# EasyEDA Pro project IMS_Baseboard.eprj

# Schematic Schematic1
Board Name: Board1; Create Date: 2025-12-21; Page Name: P1; Project Name: IMS_Baseboard; Schematic Name: Schematic1; Update Date: 2025-12-21; Company: 嘉立创EDA; Page Size: A4; Version: V1.0
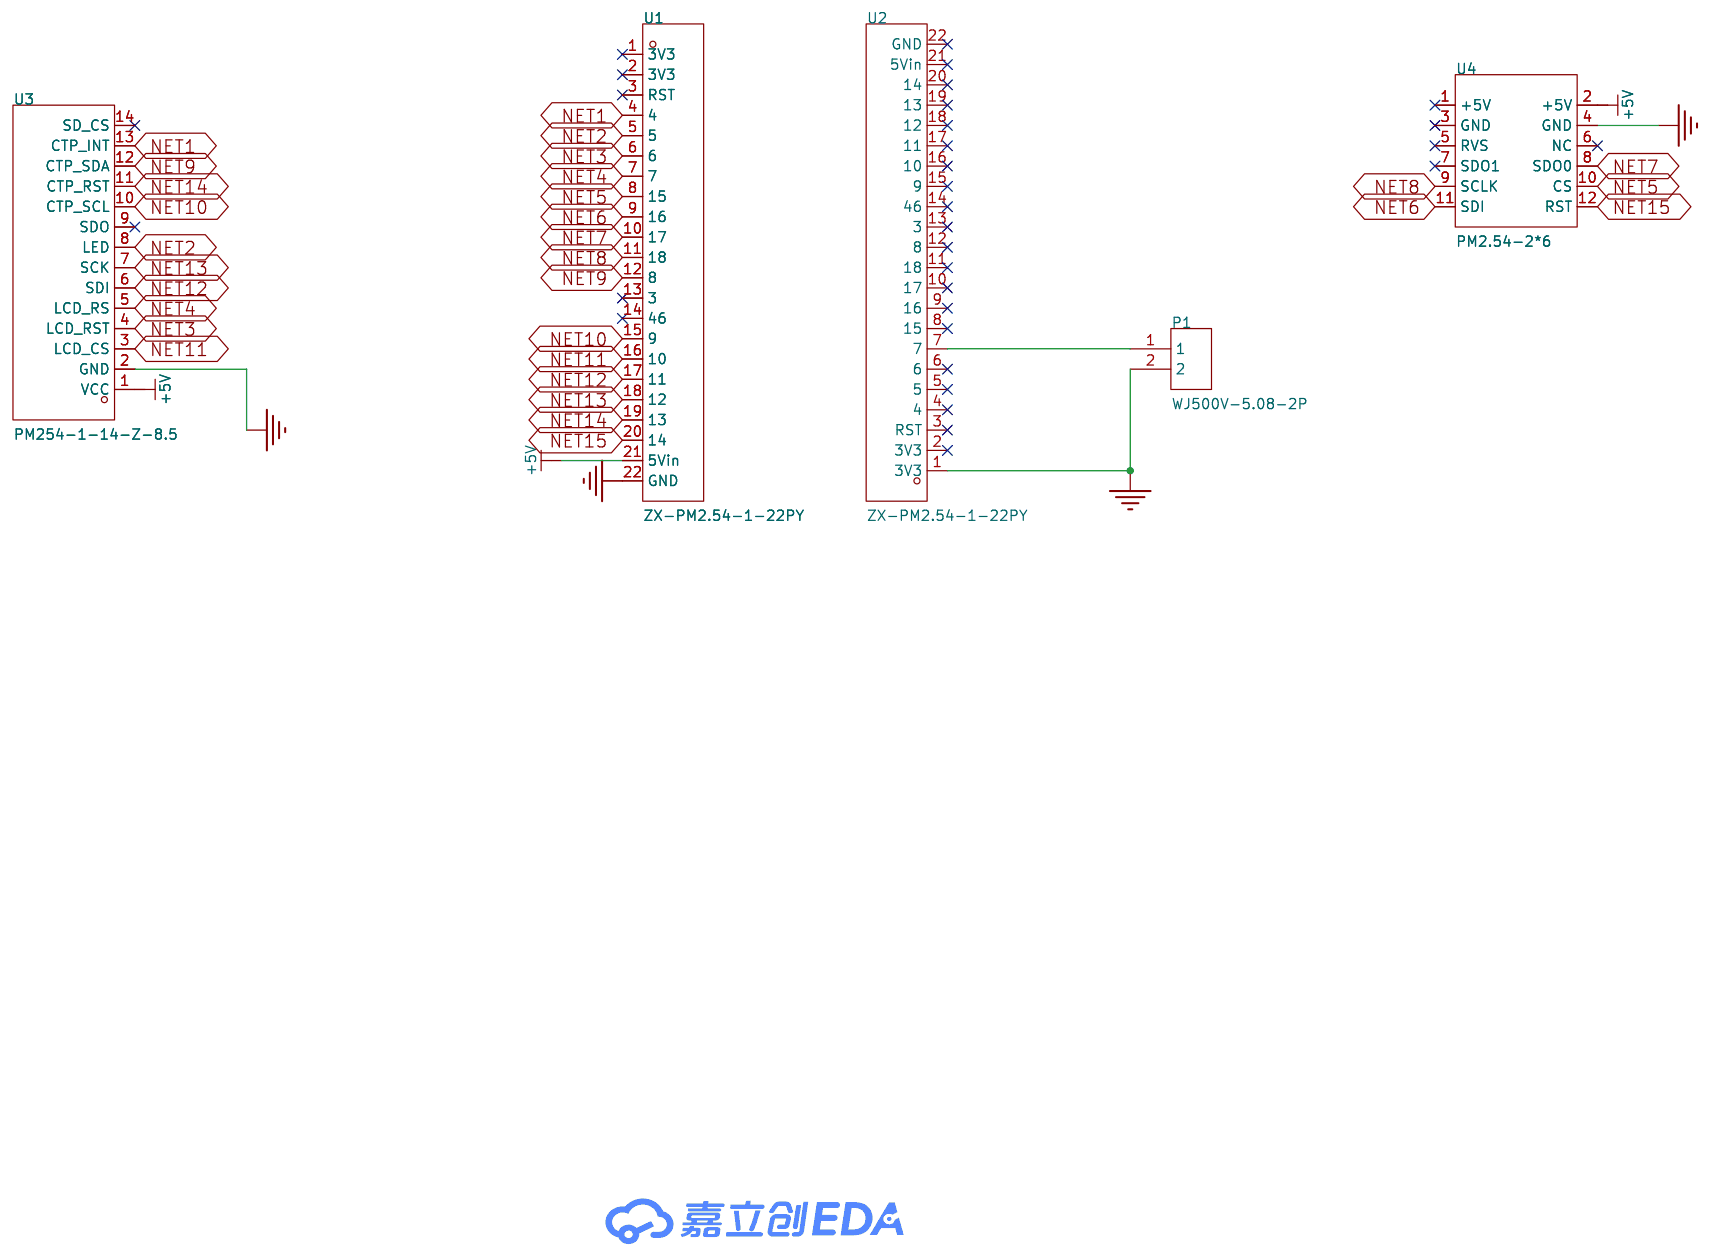
[diagram p0: schematic sheet]

## Parts
P1  WJ500V-5.08-2P  [CONN-TH_2P-P5.00_WJ500V-5.08-2P]
U1  ZX-PM2.54-1-22PY  [HDR-TH_22P-P2.54-V-F]
U2  ZX-PM2.54-1-22PY  [HDR-TH_22P-P2.54-V-F]
U3  PM254-1-14-Z-8.5  [HDR-TH_14P-P2.54-V-F-1]
U4  PM2.54-2*6  [HDR-TH_12P-P2.54-V-F-R2-C6-S2.54]

## Library data of the parts
P1 = WJ500V-5.08-2P: LCSC Part Name: 1x2P 5.08mm 直插 排数:1 每排P数:2; Supplier Part: C8465; Manufacturer: KANGNEX(康奈克斯电气); Supplier Footprint: 插件,P=5.08mm; JLCPCB Part Class: 扩展库; Datasheet: https://atta.szlcsc.com/upload/public/pdf/source/20191225/C8465_02D34CE5B5B4A53DF5891601D97FA9F4.pdf; Supplier: LCSC; Structure: 1x2P; Pitch: 5.08mm; Color: 绿色; Mounting Style: 直插; Current Rating (Max): 18A; Voltage Rating (Max): 250V; Number of Pins: 2P; Number of Rows: 1; Wire Gauge - AWG: 14~30; Wire Gauge - mm2: 2.5; Number of PINs Per Row: 2; Operating Temperature Range: -40℃~+105℃; Screw Specification: M2.5
U1 = ZX-PM2.54-1-22PY: 插孔结构:1x22P;间距:2.54mm;行距:-;圆孔/方孔:方孔;安装方式:直插;排数:单排;总孔位数:22P;额定电流:3A;额定电压:-;插孔方向:顶部;塑高:8.5mm;触头材质:黄铜;触头镀层:金;工作温度:-40℃~+105℃;; LCSC Part Name: 1x22P 间距:2.54mm 直插; Supplier Part: C7499337; Manufacturer: Megastar(兆星); Supplier Footprint: 插件,P=2.54mm; JLCPCB Part Class: 扩展库; Datasheet: https://item.szlcsc.com/datasheet/ZX-PM2.54-1-22PY/8573998.html; Supplier: LCSC; Holes Structure: 1x22P; Pitch: 2.54mm; Circular Hole / Square Hole: 方孔; Mounting Type: 直插; Number of Rows: 单排; Number of Positions: 22P; Current Rating: 3A; Holes Direction: 顶部; Insulation Height: 8.5mm; Contact Material: 黄铜; Contact Plating: 金; Operating Temperature: -40℃~+105℃; PIN Length: 3.2mm
U2 = ZX-PM2.54-1-22PY: LCSC Part Name: 1x22P 间距:2.54mm 直插; Supplier Part: C7499337; Manufacturer: Megastar(兆星); Supplier Footprint: 插件,P=2.54mm; Datasheet: https://item.szlcsc.com/datasheet/ZX-PM2.54-1-22PY/8573998.html; Supplier: LCSC; Holes Structure: 1x22P; Pitch: 2.54mm; Circular Hole / Square Hole: 方孔; Mounting Type: 直插; Number of Rows: 单排; Number of Positions: 22P; Current Rating: 3A; Holes Direction: 顶部; Insulation Height: 8.5mm; Contact Material: 黄铜; Contact Plating: 金; Operating Temperature: -40℃~+105℃; PIN Length: 3.2mm
U3 = PM254-1-14-Z-8.5-gai: LCSC Part Name: 1x14P 间距:2.54mm 直插; Supplier Part: C2897377; Manufacturer: HCTL(华灿天禄); Supplier Footprint: 插件,P=2.54mm; Datasheet: https://item.szlcsc.com/datasheet/PM254-1-14-Z-8.5/3142382.html; Supplier: LCSC; Holes Structure: 1x14P; Pitch: 2.54mm; Circular Hole / Square Hole: 方孔; Mounting Type: 直插; Number of Rows: 单排; Number of Positions: 14P; Current Rating: 3A; Holes Direction: 顶部; Insulation Height: 8.5mm; Contact Material: 铜合金; Operating Temperature: -40℃~+105℃
U4 = PM2.54-2*6-gai: LCSC Part Name: 2x6P 间距:2.54mm 直插; Supplier Part: C5307342; Manufacturer: ZHOURI(洲日); Supplier Footprint: 插件,P=2.54mm; Datasheet: https://item.szlcsc.com/datasheet/PM2.54-2*6/6060116.html; Supplier: LCSC; Holes Structure: 2x6P; Pitch: 2.54mm; Circular Hole / Square Hole: 方孔; Mounting Type: 直插; Number of Rows: 双排; Number of Positions: 12P; Current Rating: 2.5A; Holes Direction: 顶部; Insulation Height: 8.5mm; Contact Material: 黄铜; Operating Temperature: -40℃~+105℃; PIN Length: 3.2mm

## Nets
+5V: U1.21(5Vin) U3.1(VCC) U4.2(+5V)
GND: U1.22(GND) U3.2(GND)
GND1: P1.2 U2.1(GND) U4.4(GND)
NET1: U1.4 U3.13(CTP_INT)
NET2: U1.5 U3.8(LED)
NET3: U1.6 U3.4(LCD_RST)
NET4: U1.7 U3.5(LCD_RS)
NET5: U1.8(15) U4.10(CS)
NET6: U1.9(16) U4.11(SDI)
NET7: U1.10(17) U4.8(SDO0)
NET8: U1.11(18) U4.9(SCLK)
NET9: U1.12(8) U3.12(CTP_SDA)
NET10: U1.15(9) U3.10(CTP_SCL)
NET11: U1.16(10) U3.3(LCD_CS)
NET12: U1.17(11) U3.6(SDI)
NET13: U1.18(12) U3.7(SCK)
NET14: U1.19(13) U3.11(CTP_RST)
NET15: U1.20(14) U4.12(RST)
$1N4400: P1.1 U2.7(48)

Not connected (* = marked no-connect by the designer): U1 1(3V3)* 2(3V3)* 3(RST)* 13(3)* 14(46)*; U2 2(GND)* 3(19)* 4(20)* 5(21)* 6(47)* 8(45)* 9(0)* 10(35)* 11(36)* 12(37)* 13(38)* 14(39)* 15(40)* 16(41)* 17(42)* 18(2)* 19(1)* 20(RX)* 21(TX)* 22(GND)*; U3 9(SDO)* 14(SD_CS)*; U4 1(+5V)* 3(GND)* 5(RVS)* 6(NC)* 7(SDO1)*

# Board v1.0
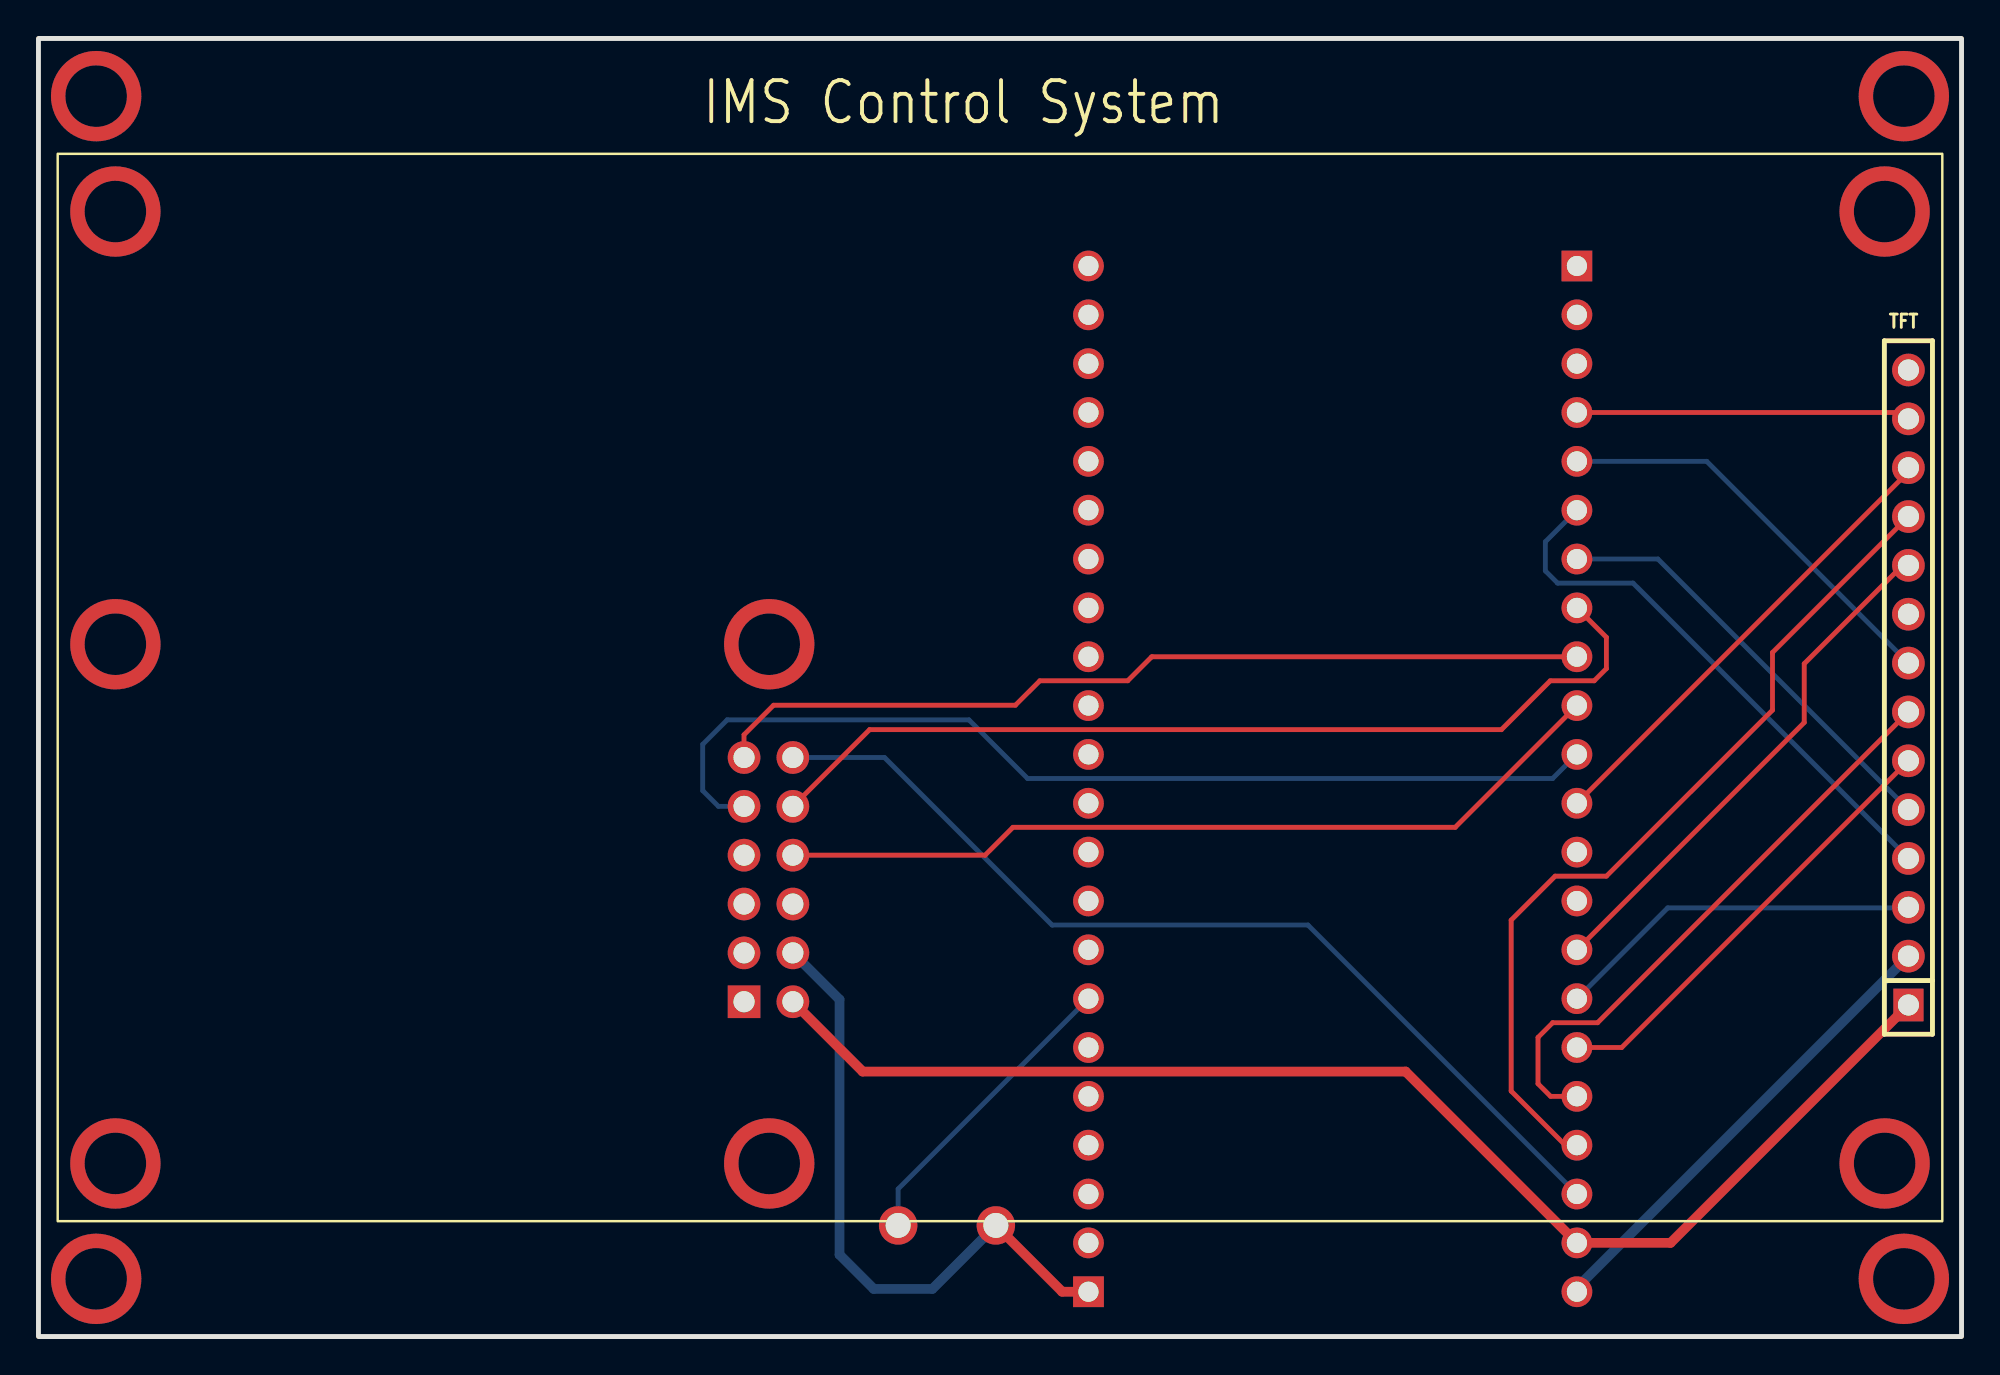
[diagram p1: board, top side]
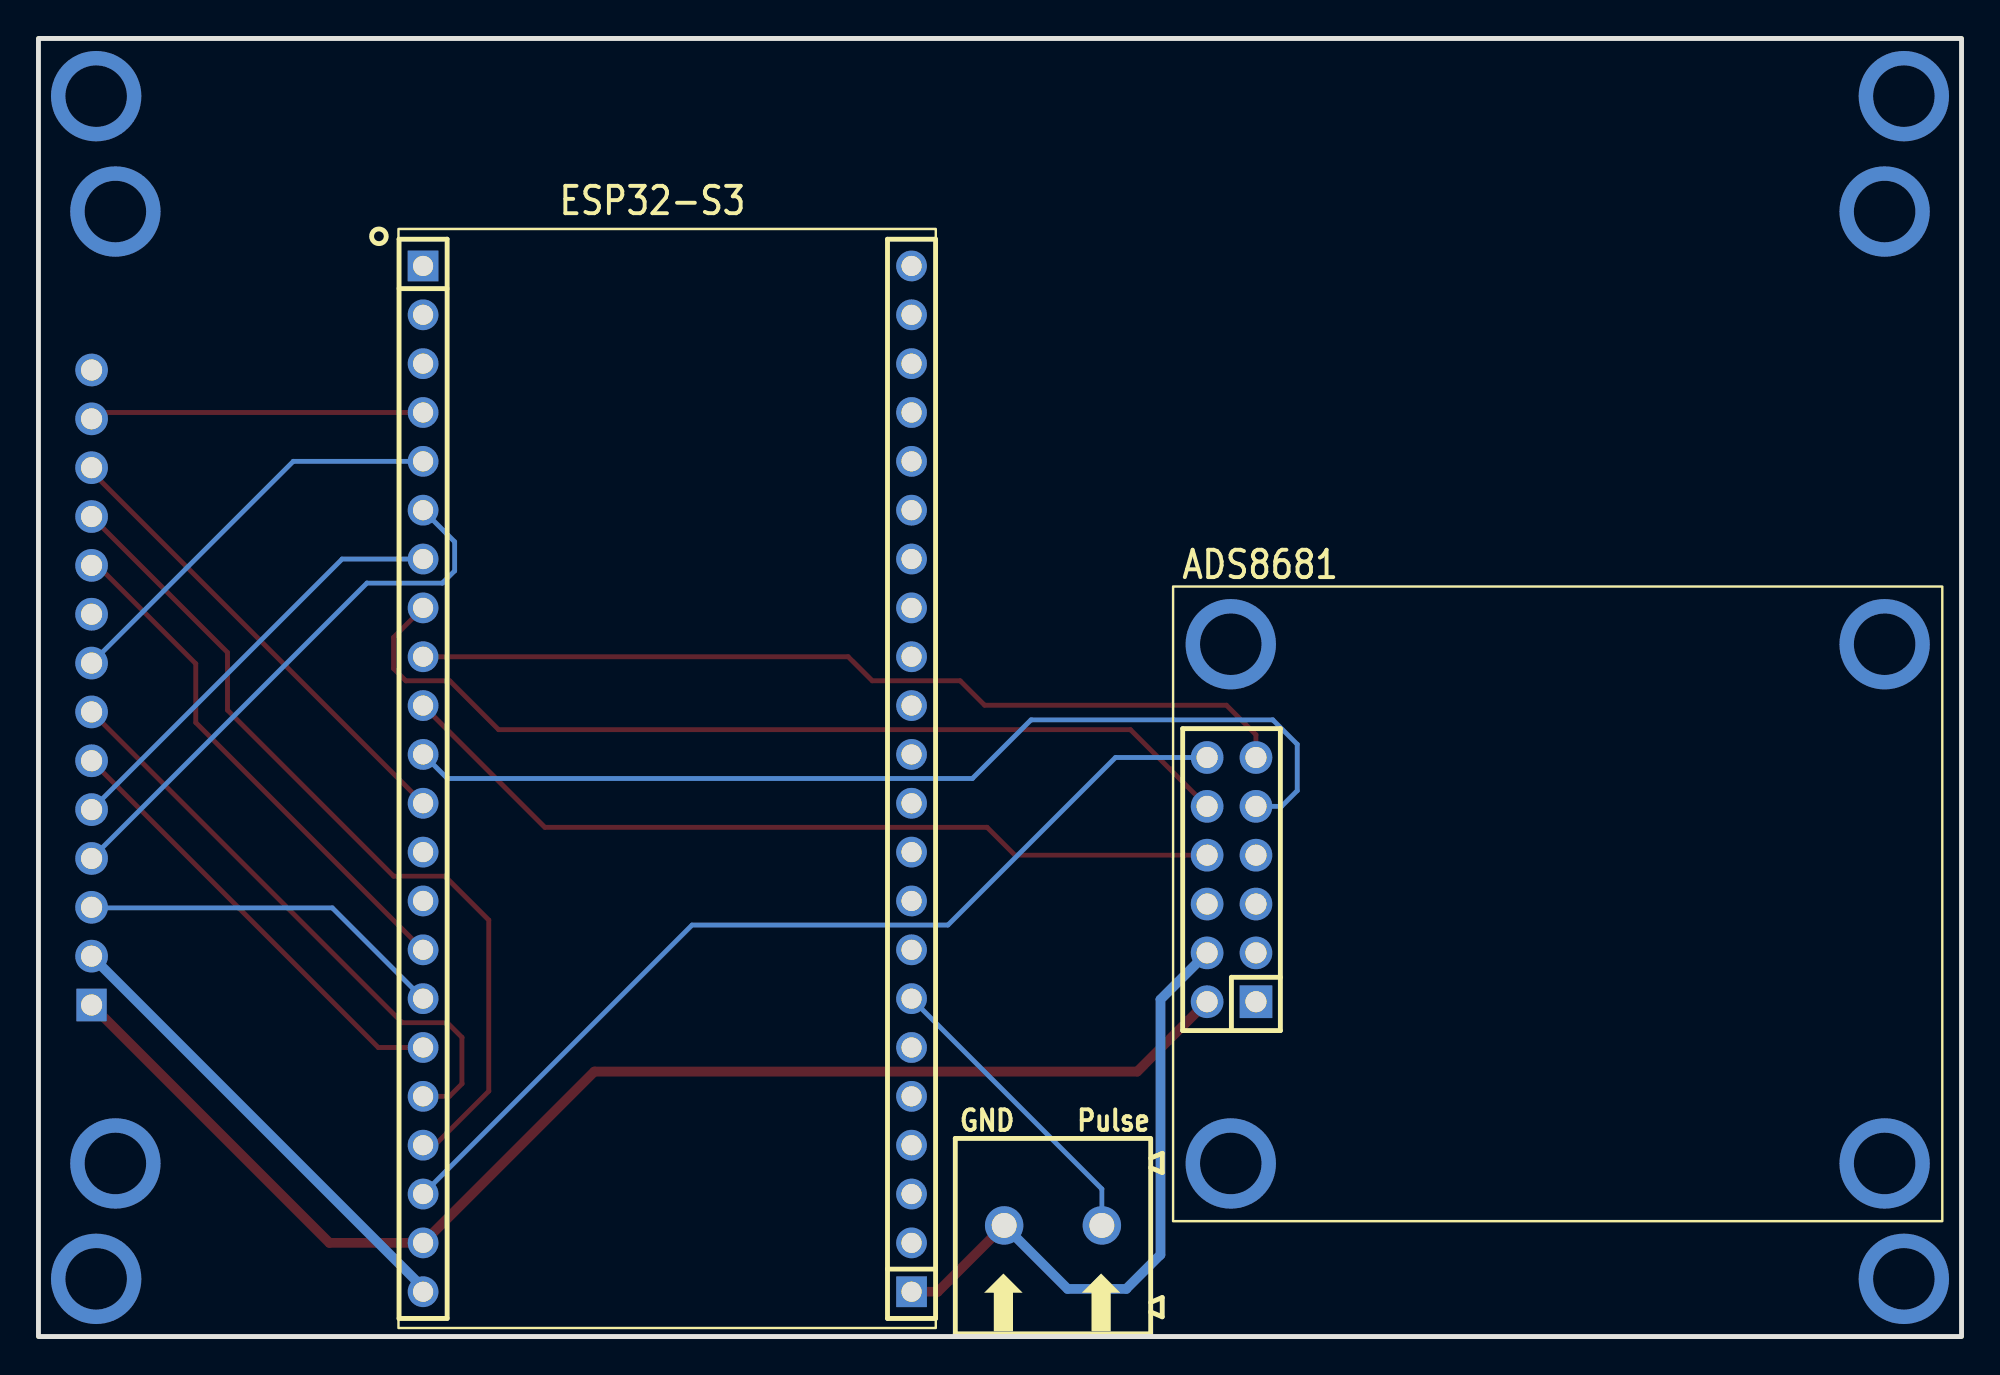
[diagram p2: board, bottom side, seen from below]

Outline 100 x 67.5 mm; copper layers: Top Layer, Bottom Layer. Coordinates in mm from the lower left corner of the outline.
Outline path: rectangle 0,67.5 100,0
Stack: Top Layer 0.035mm / Dielectric1 1.51mm FR4 er 4.5 / Bottom Layer 0.035mm

## Design rules (mm)
template: JLCPCB Capability(Two Layers Board)
spacing copperThickness1oz (default): track to track 0.102, other pairs 0.152 to 0.3
spacing copperThickness2oz: track to track 0.203, other pairs 0.152 to 0.3
track width copperThickness1oz (default): min 0.127, default 0.254, max 2.54
track width copperThickness2oz: min 0.203, default 0.254, max 2.54
differential pair differentialPair (default): width min 0.127, default 0.254, max 2.54; gap min 0.152, default 0.152
via viaSize (default): diameter min 0.5, default 0.61, max 10; hole min 0.3, default 0.305, max 6.3

## Placement (name value [footprint] x y rotation side)
P1  WJ500V-5.08-2P  [CONN-TH_2P-P5.00_WJ500V-5.08-2P]  47.24 5.78 0 bottom
TFT  PM254-1-14-Z-8.5  [HDR-TH_14P-P2.54-V-F-1]  97.24 33.75 90 top
U1  ZX-PM2.54-1-22PY  [HDR-TH_22P-P2.54-V-F]  80 29 270 bottom
U2  ZX-PM2.54-1-22PY  [HDR-TH_22P-P2.54-V-F]  54.6 29 90 bottom
U4  PM2.54-2*6  [HDR-TH_12P-P2.54-V-F-R2-C6-S2.54]  37.96 23.76 90 bottom

## Footprints (pads in the part's own frame, mm; a bottom-side part is the same pattern mirrored in y, then rotated)
CONN-TH_2P-P5.00_WJ500V-5.08-2P
  round 2 hole 1.3: 1(-2.54,0) 2(2.54,0)
HDR-TH_12P-P2.54-V-F-R2-C6-S2.54
  rect 1.7x1.7 hole 1.1: 1(-6.35,-1.27)
  round 1.7 hole 1.1: 2(-6.35,1.27) 3(-3.81,-1.27) 4(-3.81,1.27) 5(-1.27,-1.27) 6(-1.27,1.27) 7(1.27,-1.27) 8(1.27,1.27) 9(3.81,-1.27) 10(3.81,1.27) 11(6.35,-1.27) 12(6.35,1.27)
HDR-TH_14P-P2.54-V-F-1
  rect 1.7x1.575 hole 1.1: 1(-16.51,0)
  round 1.7 hole 1.1: 2(-13.97,0) 3(-11.43,0) 4(-8.89,0) 5(-6.35,0) 6(-3.81,0) 7(-1.27,0) 8(1.27,0) 9(3.81,0) 10(6.35,0) 11(8.89,0) 12(11.43,0) 13(13.97,0) 14(16.51,0)
HDR-TH_22P-P2.54-V-F
  rect 1.6x1.6 hole 1.05: 1(-26.67,0)
  round 1.6 hole 1.05: 2(-24.13,0) 3(-21.59,0) 4(-19.05,0) 5(-16.51,0) 6(-13.97,0) 7(-11.43,0) 8(-8.89,0) 9(-6.35,0) 10(-3.81,0) 11(-1.27,0) 12(1.27,0) 13(3.81,0) 14(6.35,0) 15(8.89,0) 16(11.43,0) 17(13.97,0) 18(16.51,0) 19(19.05,0) 20(21.59,0) 21(24.13,0) 22(26.67,0)

## Nets
+5V: TFT.1 U1.21 U4.2
GND: TFT.2 U1.22
GND1: P1.2 U2.1 U4.4
NET1: TFT.13 U1.4
NET2: TFT.8 U1.5
NET3: TFT.4 U1.6
NET4: TFT.5 U1.7
NET5: U1.8 U4.10
NET6: U1.9 U4.11
NET7: U1.10 U4.8
NET8: U1.11 U4.9
NET9: TFT.12 U1.12
NET10: TFT.10 U1.15
NET11: TFT.3 U1.16
NET12: TFT.6 U1.17
NET13: TFT.7 U1.18
NET14: TFT.11 U1.19
NET15: U1.20 U4.12
$1N4400: P1.1 U2.7

Pads without a net: TFT 9 14; U1 1 2 3 13 14; U2 2 3 4 5 6 8 9 10 11 12 13 14 15 16 17 18 19 20 21 22; U4 1 3 5 6 7

## Via types
v1: diameter 4.7, hole 3.2, Top Layer to Bottom Layer, 11 vias

## Routing (per net, layer and track width the routed paths; a pad name or vN(x,y) marks a point on that pad's centre or on a via; arc(x,y) is an arc through that point)
+5V: length 68.3
  Top Layer w0.508: TFT.1 84.87,4.87 U1.21 71.09,13.78 42.86,13.78 U4.2
GND: length 24.6
  Bottom Layer w0.508: U1.22 80,2.54 TFT.2
GND1: length 33.2
  Top Layer w0.508: U2.1 53.23,2.33 P1.2
  Bottom Layer w0.508: P1.2 46.48,2.48 43.43,2.48 41.66,4.25 41.66,17.52 U4.4
(no net):
  vias: v1(3,64.5) v1(3,3) v1(4,58.5) v1(4,36) v1(4,9) v1(38,36) v1(38,9) v1(96,58.5) v1(96,9) v1(97,64.5) v1(97,3)
NET1: length 17.4
  Top Layer w0.254: U1.4 96.91,48.05 TFT.13
NET2: length 21.6
  Bottom Layer w0.254: U1.5 86.75,45.51 TFT.8
NET3: length 28.9
  Bottom Layer w0.254: U1.6 78.36,41.33 78.36,39.81 78.99,39.18 82.92,39.18 TFT.4
NET4: length 22.6
  Bottom Layer w0.254: TFT.5 84.21,40.43 U1.7
NET5: length 49.1
  Top Layer w0.254: U4.10 43.22,31.56 76.07,31.56 78.61,34.1 80.9,34.1 81.53,34.73 81.53,36.36 U1.8
NET6: length 46.2
  Top Layer w0.254: U1.9 57.89,35.35 56.64,34.1 52.07,34.1 50.8,32.83 38.23,32.83 36.69,31.29 U4.11
NET7: length 44
  Top Layer w0.254: U4.8 49.22,25.03 50.67,26.48 73.67,26.48 U1.10
NET8: length 52.7
  Bottom Layer w0.254: U1.11 79.99,30.27 78.74,29.02 51.44,29.02 48.39,32.07 35.81,32.07 34.54,30.8 34.54,28.38 35.36,27.57 U4.9
NET9: length 24.6
  Top Layer w0.254: TFT.12 97.24,44.97 U1.12
NET10: length 27.3
  Top Layer w0.254: U1.15 91.82,31.93 91.82,34.99 96.93,40.1 TFT.10
NET11: length 19.2
  Bottom Layer w0.254: TFT.3 97.21,22.29 84.72,22.29 U1.16
NET12: length 23.4
  Top Layer w0.254: TFT.6 82.33,15.03 U1.17
NET13: length 31
  Top Layer w0.254: U1.18 78.63,12.49 77.98,13.14 77.98,15.56 78.74,16.32 81.08,16.32 TFT.7
NET14: length 44.6
  Top Layer w0.254: TFT.11 90.17,35.57 90.17,32.58 81.53,23.94 78.87,23.94 76.58,21.65 76.58,12.76 79.39,9.95 U1.19
NET15: length 50.2
  Bottom Layer w0.254: U4.12 43.99,30.11 52.71,21.4 66.01,21.4 U1.20
$1N4400: length 15.9
  Bottom Layer w0.254: U2.7 44.7,7.67 P1.1

## Text on the board
Bottom Silkscreen Layer: Pulse | GND | ADS8681 | ESP32-S3
Top Silkscreen Layer: IMS Control System
